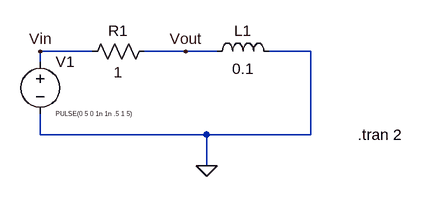
[diagram p0: schematic RLCircuit.asc]
RLCircuit.asc, the LTspice schematic file:
Version 4.1
SHEET 1 880 680
WIRE 80 64 0 64
WIRE 224 64 160 64
WIRE 272 64 224 64
WIRE 416 64 352 64
WIRE 0 80 0 64
WIRE 0 192 0 160
WIRE 256 192 0 192
WIRE 416 192 416 64
WIRE 416 192 256 192
WIRE 256 240 256 192
FLAG 256 240 0
FLAG 0 64 Vin
FLAG 224 64 Vout
SYMBOL res 176 48 R90
WINDOW 0 0 56 VBottom 2
WINDOW 3 32 56 VTop 2
SYMATTR InstName R1
SYMATTR Value 1
SYMBOL ind 256 80 R270
WINDOW 0 32 56 VTop 2
WINDOW 3 5 56 VBottom 2
SYMATTR InstName L1
SYMATTR Value 0.1
SYMBOL voltage 0 64 R0
WINDOW 3 24 96 Left 0
WINDOW 123 0 0 Left 0
WINDOW 39 0 0 Left 0
SYMATTR InstName V1
SYMATTR Value PULSE(0 5 0 1n 1n .5 1 5)
TEXT 488 192 Left 2 !.tran 2

The netlist it stands for:
* RLCircuit.asc
R1 Vout Vin 1
L1 Vout 0 0.1
V1 Vin 0 PULSE(0 5 0 1n 1n .5 1 5)
.tran 2
.backanno
.end